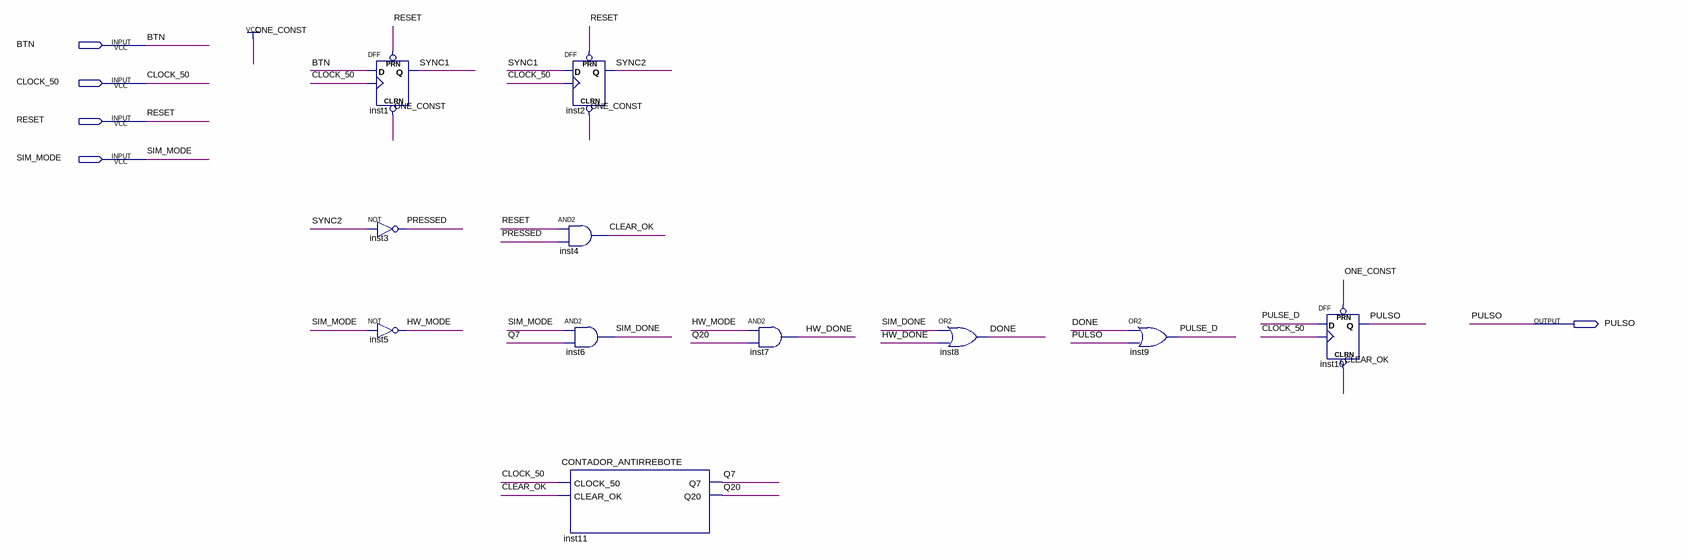
[diagram p0: schematic sheet]
// Quartus schematic ANTIRREBOTE.bdf as structural Verilog: 11 symbols, 5 pins
module ANTIRREBOTE (
  input  BTN,
  input  CLOCK_50,
  input  RESET,
  input  SIM_MODE,
  output PULSO
);

  wire CLEAR_OK, DONE, HW_DONE, HW_MODE, PRESSED, PULSE_D, Q7, Q20, SIM_DONE, SYNC1, SYNC2;

  DFF inst1 (.CLRN(1'b1), .CLK(CLOCK_50), .D(BTN), .PRN(RESET), .Q(SYNC1));
  not inst3 (PRESSED, SYNC2);
  not inst5 (HW_MODE, SIM_MODE);
  DFF inst2 (.CLRN(1'b1), .CLK(CLOCK_50), .D(SYNC1), .PRN(RESET), .Q(SYNC2));
  and inst4 (CLEAR_OK, RESET, PRESSED);
  and inst6 (SIM_DONE, SIM_MODE, Q7);
  CONTADOR_ANTIRREBOTE inst11 (.CLOCK_50(CLOCK_50), .CLEAR_OK(CLEAR_OK), .Q7(Q7), .Q20(Q20));
  and inst7 (HW_DONE, HW_MODE, Q20);
  or inst8 (DONE, SIM_DONE, HW_DONE);
  or inst9 (PULSE_D, DONE, PULSO);
  DFF inst10 (.CLRN(CLEAR_OK), .CLK(CLOCK_50), .D(PULSE_D), .PRN(1'b1), .Q(PULSO));
endmodule
